# Altium schematic sheet VGA DAC.SchDoc
size A
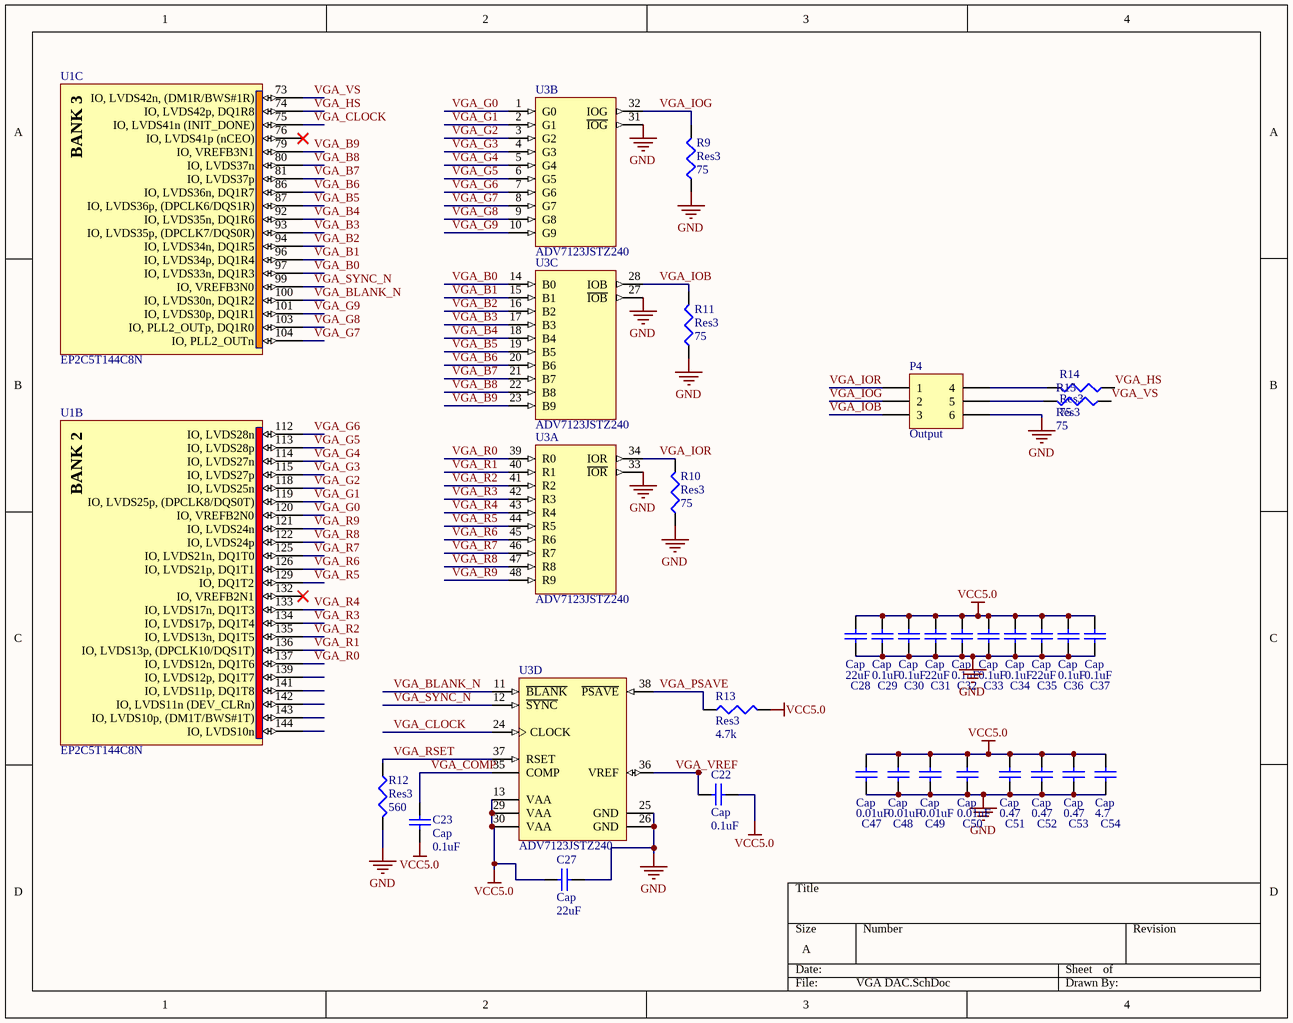
[diagram p0: VGA DAC.SchDoc]

## Parts
C22  Cap  value 0.1uF  [1608[0603]]
C23  Cap  value 0.1uF  [1608[0603]]
C27  Cap  value 22uF  [1608[0603]]
C28  Cap  value 22uF  [1608[0603]]
C29  Cap  value 0.1uF  [1608[0603]]
C30  Cap  value 0.1uF  [1608[0603]]
C31  Cap  value 22uF  [1608[0603]]
C32  Cap  value 0.1uF  [1608[0603]]
C33  Cap  value 0.1uF  [1608[0603]]
C34  Cap  value 0.1uF  [1608[0603]]
C35  Cap  value 22uF  [1608[0603]]
C36  Cap  value 0.1uF  [1608[0603]]
C37  Cap  value 0.1uF  [1608[0603]]
C47  Cap  value 0.01uF  [1608[0603]]
C48  Cap  value 0.01uF  [1608[0603]]
C49  Cap  value 0.01uF  [1608[0603]]
C50  Cap  value 0.01uF  [1608[0603]]
C51  Cap  value 0.47  [1608[0603]]
C52  Cap  value 0.47  [1608[0603]]
C53  Cap  value 0.47  [1608[0603]]
C54  Cap  value 4.7  [1608[0603]]
P4  Output  [HDR2X3_CEN]
R9  Res3  value 75  [J1-0603]
R10  Res3  value 75  [J1-0603]
R11  Res3  value 75  [J1-0603]
R12  Res3  value 560  [J1-0603]
R13  Res3  value 4.7k  [J1-0603]
R14  Res3  value 75  [J1-0603]
R15  Res3  value 75  [J1-0603]
U1  EP2C5T144C8N  [TQFP144_N]  (parts B,C of 9)
U3  ADV7123JSTZ240  [ST-48_N]  (parts A,B,C,D of 4)

## Nets
GND: C27.1 C28.2 C29.2 C30.2 C31.2 C32.2 C33.2 C34.2 C35.2 C36.2 C37.2 C47.2 C48.2 C49.2 C50.2 C51.2 C52.2 C53.2 C54.2 P4.6 R9.1 R10.1 R11.1 R12.2 U3.25(GND) U3.26(GND) U3.27(~{IOB}) U3.31(~{IOG}) U3.33(~{IOR})
VCC5.0: C22.1 C23.2 C27.2 C28.1 C29.1 C30.1 C31.1 C32.1 C33.1 C34.1 C35.1 C36.1 C37.1 C47.1 C48.1 C49.1 C50.1 C51.1 C52.1 C53.1 C54.1 R13.2 U3.13(VAA) U3.29(VAA) U3.30(VAA)
VGA_B0: U1.97(IO,_LVDS33n,_DQ1R3) U3.14(B0)
VGA_B1: U1.96(IO,_LVDS34p,_DQ1R4) U3.15(B1)
VGA_B2: U1.94(IO,_LVDS34n,_DQ1R5) U3.16(B2)
VGA_B3: U1.93(IO,_LVDS35p,_(DPCLK7/DQS0R)) U3.17(B3)
VGA_B4: U1.92(IO,_LVDS35n,_DQ1R6) U3.18(B4)
VGA_B5: U1.87(IO,_LVDS36p,_(DPCLK6/DQS1R)) U3.19(B5)
VGA_B6: U1.86(IO,_LVDS36n,_DQ1R7) U3.20(B6)
VGA_B7: U1.81(IO,_LVDS37p) U3.21(B7)
VGA_B8: U1.80(IO,_LVDS37n) U3.22(B8)
VGA_B9: U1.79(IO,_VREFB3N1) U3.23(B9)
VGA_BLANK_N: U1.100(IO,_LVDS30n,_DQ1R2) U3.11(~{BLANK})
VGA_CLOCK: U1.75(IO,_LVDS41n_(INIT_DONE)) U3.24(CLOCK)
VGA_COMP: C23.1 U3.35(COMP)
VGA_G0: U1.120(IO,_VREFB2N0) U3.1(G0)
VGA_G1: U1.119(IO,_LVDS25p,_(DPCLK8/DQS0T)) U3.2(G1)
VGA_G2: U1.118(IO,_LVDS25n) U3.3(G2)
VGA_G3: U1.115(IO,_LVDS27p) U3.4(G3)
VGA_G4: U1.114(IO,_LVDS27n) U3.5(G4)
VGA_G5: U1.113(IO,_LVDS28p) U3.6(G5)
VGA_G6: U1.112(IO,_LVDS28n) U3.7(G6)
VGA_G7: U1.104(IO,_PLL2_OUTn) U3.8(G7)
VGA_G8: U1.103(IO,_PLL2_OUTp,_DQ1R0) U3.9(G8)
VGA_G9: U1.101(IO,_LVDS30p,_DQ1R1) U3.10(G9)
VGA_HS: R14.1 U1.74(IO,_LVDS42p,_DQ1R8)
VGA_IOB: P4.3 R11.2 U3.28(IOB)
VGA_IOG: P4.2 R9.2 U3.32(IOG)
VGA_IOR: P4.1 R10.2 U3.34(IOR)
VGA_PSAVE: R13.1 U3.38(~{PSAVE})
VGA_R0: U1.137(IO,_LVDS12n,_DQ1T6) U3.39(R0)
VGA_R1: U1.136(IO,_LVDS13p,_(DPCLK10/DQS1T)) U3.40(R1)
VGA_R2: U1.135(IO,_LVDS13n,_DQ1T5) U3.41(R2)
VGA_R3: U1.134(IO,_LVDS17p,_DQ1T4) U3.42(R3)
VGA_R4: U1.133(IO,_LVDS17n,_DQ1T3) U3.43(R4)
VGA_R5: U1.129(IO,_DQ1T2) U3.44(R5)
VGA_R6: U1.126(IO,_LVDS21p,_DQ1T1) U3.45(R6)
VGA_R7: U1.125(IO,_LVDS21n,_DQ1T0) U3.46(R7)
VGA_R8: U1.122(IO,_LVDS24p) U3.47(R8)
VGA_R9: U1.121(IO,_LVDS24n) U3.48(R9)
VGA_RSET: R12.1 U3.37(RSET)
VGA_SYNC_N: U1.99(IO,_VREFB3N0) U3.12(~{SYNC})
VGA_VREF: C22.2 U3.36(VREF)
VGA_VS: R15.1 U1.73(IO,_LVDS42n,_(DM1R/BWS#1R))
NetP4_4: P4.4 R14.2
NetP4_5: P4.5 R15.2

Not connected (* = marked no-connect by the designer): U1 76(IO,_LVDS41p_(nCEO))* 132(IO,_VREFB2N1)* 139(IO,_LVDS12p,_DQ1T7) 141(IO,_LVDS11p,_DQ1T8) 142(IO,_LVDS11n_(DEV_CLRn)) 143(IO,_LVDS10p,_(DM1T/BWS#1T)) 144(IO,_LVDS10n)

## Notes on the sheet
- (in symbol EP2C5T144C8N, part B) BANK 2
- (in symbol EP2C5T144C8N, part C) BANK 3

## Library data of the parts
C22 C23 C27-C37 C47-C54 = Cap Semi: Capacitor (Semiconductor SIM Model); Published: 8-Jun-2000; LatestRevisionDate: 29-May-2009; LatestRevisionNote: IPC-7351 Footprint Added.; PackageReference: C1206; Publisher: Altium Limited; PackageDescription: Chip Capacitor
P4 = Header 3X2A: Header, 3-Pin, Dual row; LatestRevisionDate: 17-Jul-2002; LatestRevisionNote: Re-released for DXP Platform.; Publisher: Altium Limited
R9-R15 = Res3: Resistor; Published: 8-Jun-2000; LatestRevisionDate: 29-May-2009; LatestRevisionNote: IPC-7351 Footprint Added.; PackageReference: J1-0603; Publisher: Altium Limited; PackageDescription: Chip Resistor
U1 = EP2C5T144C8N: Cyclone II Family, 1.2V FPGA, 89 I/O Pins, 2 PLLs, 144-Pin TQFP, Speed Grade 8, Commercial Grade, Pb-Free; Published: 4-Mar-2005; LatestRevisionDate: 14-May-2007; LatestRevisionNote: DATA0 pin is now INPUT.; DatasheetVersion: ver3.3, Feb-2008; PackageVersion: ver15.4, Dec-2008; PackageReference: TQFP144; Publisher: Altium Limited; PackageDescription: 144-Pin Plastic Thin Quad Flat Pack (TQFP144) - Wire Bond; Supplier 1: Digi-Key; Supplier Part Number 1: 544-1665-ND; Supplier 2: Farnell; Supplier Part Number 2: 1662263; Supplier 3: Farnell; Supplier Part Number 3: 1453497; Code_JEDEC: MS-026-BFB; ComponentLink1Description: Manufacturer Link; ComponentLink1URL: http://www.altera.com/products/devices/cyclone2/cy2-index.jsp; ComponentLink2Description: Handbook; ComponentLink2URL: http://www.altera.com/literature/hb/cyc2/cyc2_cii5v1.pdf; ComponentLink3Description: Packaging Specification; ComponentLink3URL: http://www.altera.com/literature/ds/dspkg.pdf
U3 = ADV7123JSTZ240: 3 Channel 10-Bit CMOS High Speed Video Digital-to-Analog Converter, 330 MHz, 0 to 70 degC, ST-48, Pb-Free, Tray; Manufacturer: Analog Devices; # DAC Outputs: 3; Max V+: 5.25V; Op Pwr Diss: 485mW; Resolution (Bits): 10; Settling Time: 15ns; Single Supply: Yes; DatasheetVersion: Rev.D; PackageVersion: revA; PackageReference: ST-48; PackageDescription: 48-Pin Thin Quad Flat Pack 0.5 mm Pitch; Supplier 1: Digi-Key; Supplier Part Number 1: ADV7123JSTZ240-ND; Supplier 2: Farnell; Supplier Part Number 2: 1438732; Supplier 3: Newark; Supplier Part Number 3: 19M8771; Supplier 4: Mouser; Supplier Part Number 4: 584-ADV7123JSTZ240; Generic Part Number: ADV7123; Packing: Tray; RoHS: Y; Mounting Technology: Surface Mount; PartNumber: ADV7123JSTZ240; ComponentLink1Description: Manufacturer URL; ComponentLink1URL: http://www.analog.com/en/index.html; ComponentLink2Description: Datasheet; ComponentLink2URL: http://www.analog.com/static/imported-files/data_sheets/ADV7123.pdf; ComponentLink3Description: Package Specification; ComponentLink3URL: http://www.analog.com/static/imported-files/packages/PKG_PDF/LQFP%28ST%29/ST_48.pdf; ComponentLink4Description: Product URL; ComponentLink4URL: http://www.analog.com/en/digital-to-analog-converters/da-converters/adv7123/products/product.html